# Altium schematic sheet main_processor.SchDoc
size A4
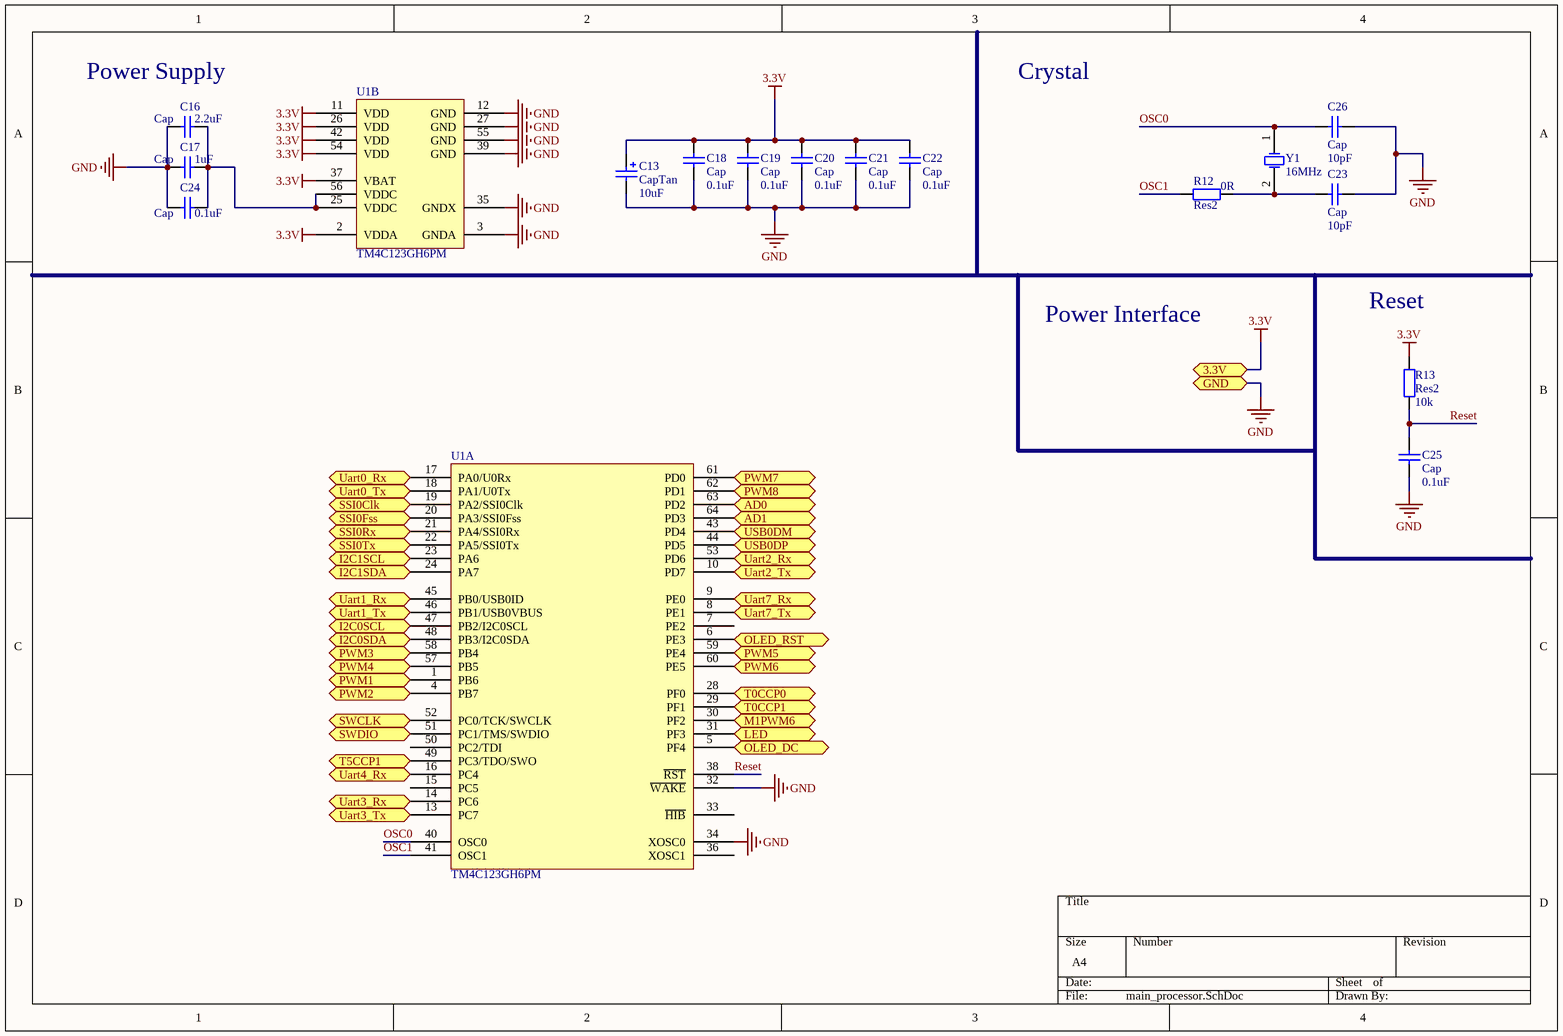
[diagram p0: main_processor.SchDoc]

## Parts
C13  CapTan  value 10uF  [1206_P]
C16  Cap  value 2.2uF  [0603]
C17  Cap  value 1uF  [0603]
C18  Cap  value 0.1uF  [0603]
C19  Cap  value 0.1uF  [0603]
C20  Cap  value 0.1uF  [0603]
C21  Cap  value 0.1uF  [0603]
C22  Cap  value 0.1uF  [0603]
C23  Cap  value 10pF  [0603]
C24  Cap  value 0.1uF  [0603]
C25  Cap  value 0.1uF  [0603]
C26  Cap  value 10pF  [0603]
R12  Res2  value 0R  [0603]
R13  Res2  value 10k  [0603]
U1  TM4C123GH6PM  [TI-PQFP-G64]  (parts A,B of 2)
Y1  16MHz  [Crystal_SMD_3225]

## Ports
3.3V, AD0, AD1, GND, I2C0SCL (out), I2C0SDA (out), I2C1SCL (out), I2C1SDA (out), LED, M1PWM6, OLED_DC, OLED_RST, PWM1 (out), PWM2 (out), PWM3 (out), PWM4 (out), PWM5 (out), PWM6 (out), PWM7 (out), PWM8 (out), SSI0Clk (out), SSI0Fss (out), SSI0Rx (out), SSI0Tx (out), SWCLK (in), SWDIO (bidir), T0CCP0, T0CCP1, T5CCP1, Uart0_Rx (in), Uart0_Tx (out), Uart1_Rx (in), Uart1_Tx (out), Uart2_Rx (in), Uart2_Tx (out), Uart3_Rx (in), Uart3_Tx (out), Uart4_Rx (in), Uart7_Rx (in), Uart7_Tx (out), USB0DM (bidir), USB0DP (bidir)

## Nets
3.3V: C13.1 C18.2 C19.2 C20.2 C21.2 C22.2 R13.2 U1.2(VDDA) U1.11(VDD) U1.26(VDD) U1.37(VBAT) U1.42(VDD) U1.54(VDD) ; port 3.3V
GND: C13.2 C16.1 C17.1 C18.1 C19.1 C20.1 C21.1 C22.1 C23.1 C24.1 C25.1 C26.1 U1.3(GNDA) U1.12(GND) U1.27(GND) U1.32(~{WAKE}) U1.34(XOSC0) U1.35(GNDX) U1.39(GND) U1.55(GND) ; port GND
AD0: U1.63(PD2) ; port AD0
AD1: U1.64(PD3) ; port AD1
I2C0SCL: U1.47(PB2/I2C0SCL) ; port I2C0SCL
I2C0SDA: U1.48(PB3/I2C0SDA) ; port I2C0SDA
I2C1SCL: U1.23(PA6) ; port I2C1SCL
I2C1SDA: U1.24(PA7) ; port I2C1SDA
LED: U1.31(PF3) ; port LED
M1PWM6: U1.30(PF2) ; port M1PWM6
OLED_DC: U1.5(PF4) ; port OLED_DC
OLED_RST: U1.6(PE3) ; port OLED_RST
OSC0: C26.2 U1.40(OSC0) Y1.1(OSC1)
OSC1: R12.1 U1.41(OSC1)
PWM1: U1.1(PB6) ; port PWM1
PWM2: U1.4(PB7) ; port PWM2
PWM3: U1.58(PB4) ; port PWM3
PWM4: U1.57(PB5) ; port PWM4
PWM5: U1.59(PE4) ; port PWM5
PWM6: U1.60(PE5) ; port PWM6
PWM7: U1.61(PD0) ; port PWM7
PWM8: U1.62(PD1) ; port PWM8
Reset: C25.2 R13.1 U1.38(~{RST})
SSI0Clk: U1.19(PA2/SSI0Clk) ; port SSI0Clk
SSI0Fss: U1.20(PA3/SSI0Fss) ; port SSI0Fss
SSI0Rx: U1.21(PA4/SSI0Rx) ; port SSI0Rx
SSI0Tx: U1.22(PA5/SSI0Tx) ; port SSI0Tx
SWCLK: U1.52(PC0/TCK/SWCLK) ; port SWCLK
SWDIO: U1.51(PC1/TMS/SWDIO) ; port SWDIO
T0CCP0: U1.28(PF0) ; port T0CCP0
T0CCP1: U1.29(PF1) ; port T0CCP1
T5CCP1: U1.49(PC3/TDO/SWO) ; port T5CCP1
Uart0_Rx: U1.17(PA0/U0Rx) ; port Uart0_Rx
Uart0_Tx: U1.18(PA1/U0Tx) ; port Uart0_Tx
Uart1_Rx: U1.45(PB0/USB0ID) ; port Uart1_Rx
Uart1_Tx: U1.46(PB1/USB0VBUS) ; port Uart1_Tx
Uart2_Rx: U1.53(PD6) ; port Uart2_Rx
Uart2_Tx: U1.10(PD7) ; port Uart2_Tx
Uart3_Rx: U1.14(PC6) ; port Uart3_Rx
Uart3_Tx: U1.13(PC7) ; port Uart3_Tx
Uart4_Rx: U1.16(PC4) ; port Uart4_Rx
Uart7_Rx: U1.9(PE0) ; port Uart7_Rx
Uart7_Tx: U1.8(PE1) ; port Uart7_Tx
USB0DM: U1.43(PD4) ; port USB0DM
USB0DP: U1.44(PD5) ; port USB0DP
NetC16_2: C16.2 C17.2 C24.2 U1.25(VDDC) U1.56(VDDC)
NetC23_2: C23.2 R12.2 Y1.2(OSC2)

Not connected (* = marked no-connect by the designer): U1 7(PE2) 15(PC5) 33(~{HIB}) 36(XOSC1) 50(PC2/TDI)

## Notes on the sheet
- (near C16) Power Supply
- Crystal
- Reset
- Power Interface

## Library data of the parts
C13 = Cap Pol2: Polarized Capacitor (Axial); Published: 8-Jun-2000; LatestRevisionDate: 17-Jul-2002; LatestRevisionNote: Re-released for DXP Platform.; PackageReference: POLAR0.8; Publisher: Altium Limited; PackageDescription: Polarized Capacitor; 2 Leads
C16-C26 = Cap: Capacitor; Published: 8-Jun-2000; LatestRevisionDate: 17-Jul-2002; LatestRevisionNote: Re-released for DXP Platform.; PackageReference: RAD-0.3; Publisher: Altium Limited; PackageDescription: Radial Cap, Thru-Hole; 2 Leads; 0.3 in Pin Spacing
R12 R13 = Res2: Resistor; Published: 8-Jun-2000; LatestRevisionDate: 17-Jul-2002; LatestRevisionNote: Re-released for DXP Platform.; PackageReference: AXIAL-0.4; Publisher: Altium Limited; PackageDescription: Axial Device, Thru-Hole; 2 Leads; 0.4 in Pin Spacing
Y1 = XTAL: Crystal Oscillator; Published: 8-Jun-2000; LatestRevisionDate: 17-Jul-2002; LatestRevisionNote: Re-released for DXP Platform.; Publisher: Altium Limited